# Altium schematic sheet AO3401.schdoc
size 127 x 101 mm
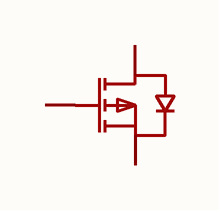
[diagram p0: AO3401.schdoc]

## Parts
Q?  AO3401A  [SOT-23_L2.9-W1.3-P1.90-LS2.4-BR]  (value not drawn)

## Nets

Not connected (* = marked no-connect by the designer): Q? 1(G) 2(S) 3(D)

## Library data of the parts
Q? = AO3401A_C15127: Manufacturer: AOS; Add into BOM: yes; Type: 1个PChannel; Drain Source On Resistance (RDS(on)@Vgs,Id): 44mΩ@10V,4.3A; Gate Threshold Voltage (Vgs(th)@Id): 1.3V@250uA; Total Gate Charge (Qg@Vgs): 12.2nC@4.5V; Input Capacitance (Ciss@Vds): 1.2nF@15V; Symbol: AO3401A; Device: AO3401A_C15127; LCSC Part Name: 1个P沟道 耐压:30V 电流:4A; Supplier Part: C15127; Manufacturer Part: AO3401A; Supplier Footprint: SOT-23; JLCPCB Part Class: Basic Part; Datasheet: https://atta.szlcsc.com/upload/public/pdf/source/20160507/1462613609053.pdf; Supplier: LCSC; Convert to PCB: yes; Operating Temperature: -55℃~+150℃@(Tj)